# Altium schematic sheet DCconverter.SchDoc
size A4
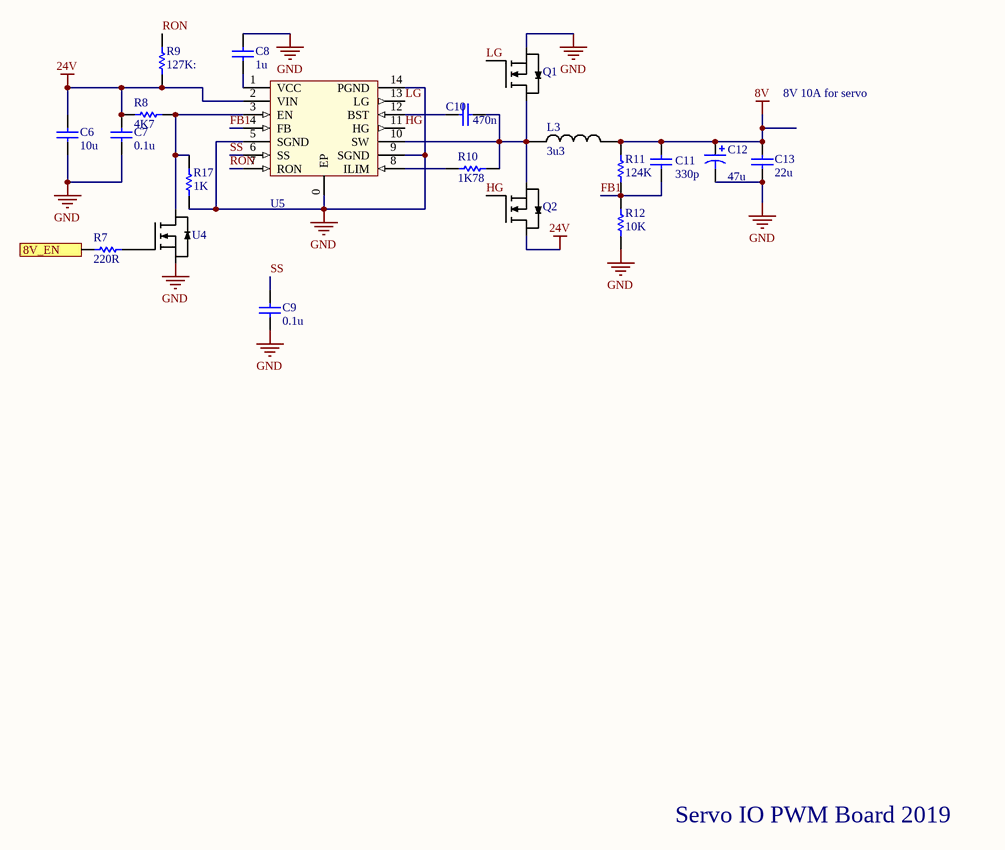
[diagram p0: DCconverter.SchDoc]

## Parts
C6  value 10u  [CAPC2012X135N]  (hidden comment: Cap)
C7  value 0.1u  [CAPC1608X90N]  (hidden comment: Cap)
C8  value 1u  [CAPC1608X90N]  (hidden comment: Cap)
C9  value 0.1u  [CAPC1608X90N]  (hidden comment: Cap)
C10  value 470n  [CAPC2012X135N]  (hidden comment: Cap)
C11  value 330p  [CAPC1608X90N]  (hidden comment: Cap)
C12  value 47u  [CAP_ELEC_SIZE_E]  (hidden comment: Cap Pol1)
C13  value 22u  [CAPC3216X100N]  (hidden comment: Cap)
L3  inductance: 3u3  [IND_7x7x3]  (hidden comment: 3.3uH 8A sat.)
Q1  60V N-Channel MOSFET  [SON_5x6_NexFET]  (value not drawn)
Q2  60V N-Channel MOSFET  [SON_5x6_NexFET]  (value not drawn)
R7  value 220R  [RESC1608X55N]  (hidden comment: Res1)
R8  value 4K7  [RESC1608X55N]  (hidden comment: Res1)
R9  value 127K:  [RESC1608X55N]  (hidden comment: Res1)
R10  value 1K78  [RESC1608X55N]  (hidden comment: Res1)
R11  value 124K  [RESC1608X55N]  (hidden comment: Res1)
R12  value 10K  [RESC1608X55N]  (hidden comment: Res1)
R17  value 1K  [RESC1608X55N]  (hidden comment: Res1)
U4  Enhancing mode mosfet  [SOT323]  (value not drawn)
U5  LM3150 buck converter  [HTSSOP14]  (value not drawn)

## Ports
8V_EN (in)

## Nets
8V: C11.2 C12.1 C13.2 L3.2 R11.2
24V: C6.2 C7.2 Q2.4(D) R8.1 R9.1 U5.2(VIN)
GND: C6.1 C7.1 C8.2 C9.1 C12.2 C13.1 Q1.3(S) R12.1 R17.1 U4.2(S) U5.0(EP) U5.5(SGND) U5.9(SGND) U5.14(PGND)
8V_EN: R7.1 ; port 8V_EN
FB1: C11.1 R11.1 R12.2 U5.4(FB)
HG: Q2.1(G) U5.11(HG)
LG: Q1.1(G) U5.13(LG)
RON: R9.2 U5.7(RON)
SS: C9.2 U5.6(SS)
NetC8_1: C8.1 U5.1(VCC)
NetC10_1: C10.1 U5.12(BST)
NetC10_2: C10.2 L3.1 Q1.4(D) Q2.3(S) R10.2 U5.10(SW)
NetR7_2: R7.2 U4.1(G)
NetR8_2: R8.2 R17.2 U4.3(D) U5.3(EN)
NetR10_1: R10.1 U5.8(ILIM)

## Notes on the sheet
- 8V 10A for servo
- Servo IO PWM Board 2019

## Library data of the parts
C6-C11 C13 = Cap: Capacitor; Published: 8-Jun-2000; LatestRevisionDate: 17-Jul-2002; LatestRevisionNote: Re-released for DXP Platform.; PackageReference: RAD-0.3; Publisher: Altium Limited; PackageDescription: Radial Cap, Thru-Hole; 2 Leads; 0.3 in Pin Spacing
C12 = Cap Pol1: Polarized Capacitor (Radial); Published: 8-Jun-2000; LatestRevisionDate: 17-Jul-2002; LatestRevisionNote: Re-released for DXP Platform.; PackageReference: RB7.6-15; Publisher: Altium Limited; PackageDescription: Polarized Capacitor (Radial); 2 Leads
L3 = SRP6030CA-3R3M: 3.3uH inductor SMD. 8-12A Sat. Current; Current: 10A
Q1 Q2 = CSD18534Q5A: 60V N-Channel NexFET Power MOSFET. 14A minimum depending on temperature
R7-R12 R17 = Res1: Resistor; Published: 8-Jun-2000; LatestRevisionDate: 17-Jul-2002; LatestRevisionNote: Re-released for DXP Platform.; PackageReference: AXIAL-0.3; Publisher: Altium Limited; PackageDescription: Axial Device, Thru-Hole; 2 Leads; 0.3 in Pin Spacing
U4 = DMN63D8LW-13: Small N channel MOSFET as a level shifter.; Rds @ Vgs = 2.5V 250mA: 13R; Rds @ Vgs = 5V 250mA: 2.5R; Vds max: 30V; Vgs max: 20V; Id: 300mA
U5 = LM3150: VIN_MIN: 6V; VIN_MAX: 42V; Parameter 1: *